# Altium schematic sheet XMOS_MAX3420E.SchDoc: MAXIM MAX3420E USB Device Module
size A4
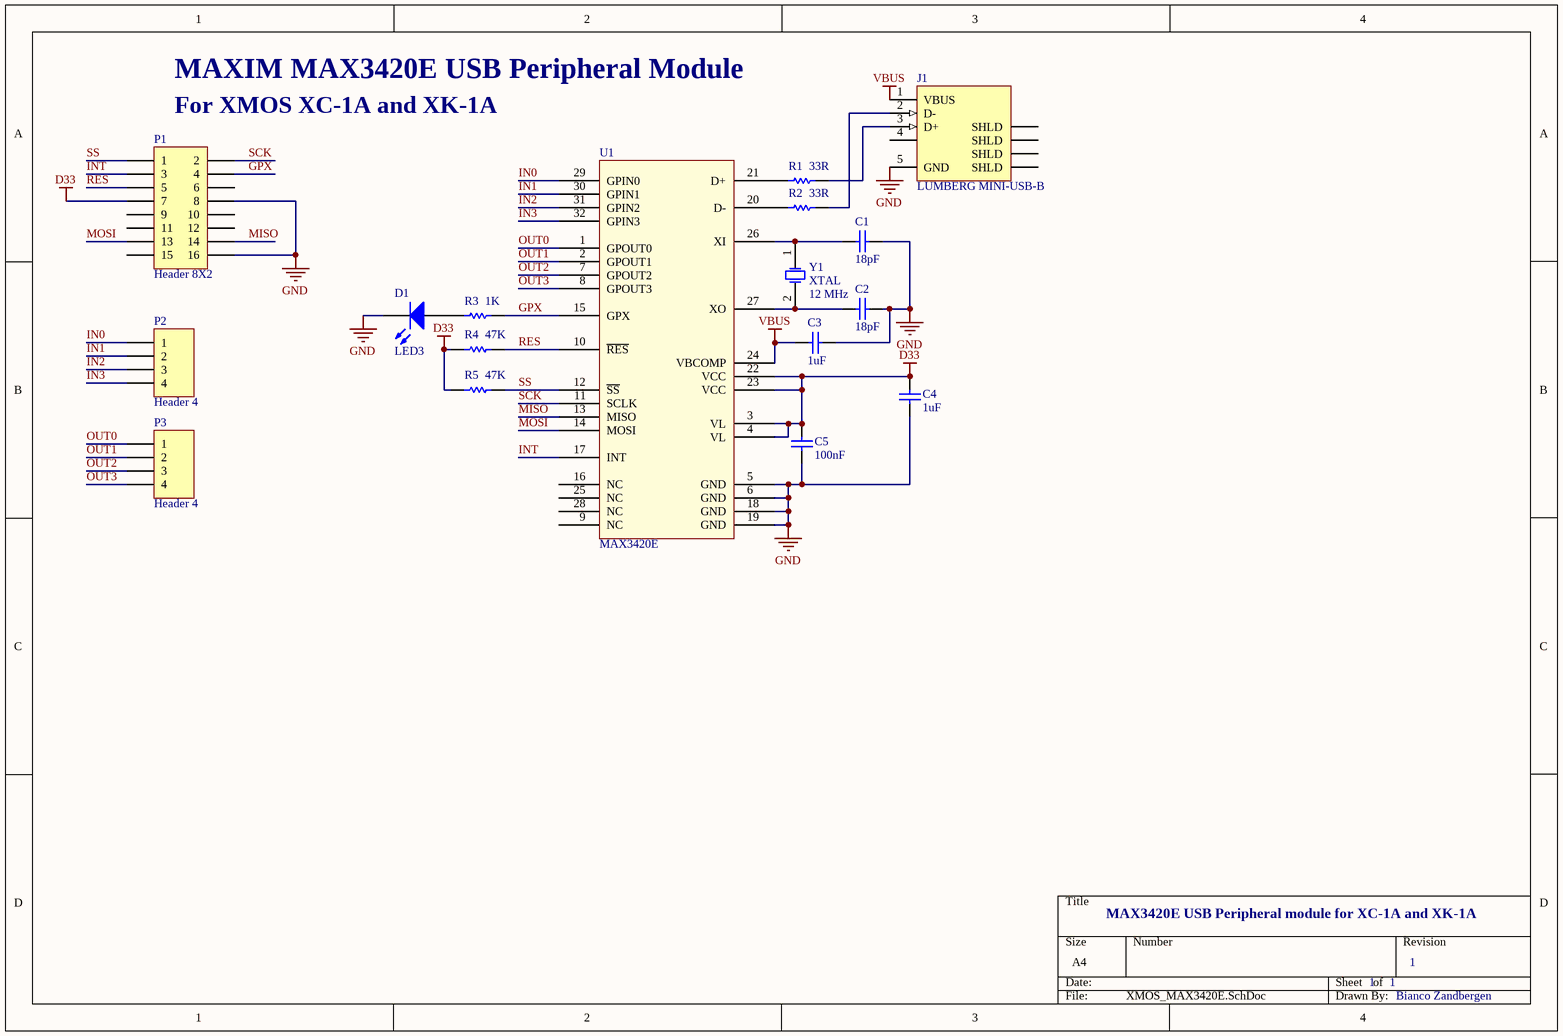
[diagram p0: XMOS_MAX3420E.SchDoc]

## Parts
C1  value 18pF  [1608[0603]_CAP]  (hidden comment: Cap)
C2  value 18pF  [1608[0603]_CAP]  (hidden comment: Cap)
C3  value 1uF  [1608[0603]_CAP]  (hidden comment: Cap)
C4  value 1uF  [1608[0603]_CAP]  (hidden comment: Cap)
C5  value 100nF  [1608[0603]_CAP]  (hidden comment: Cap)
D1  LED3  [2012[0805]_LED]
J1  LUMBERG MINI-USB-B  [LUMBERG mini USB-B]
P1  Header 8X2  [HDR2X8]
P2  Header 4  [HDR1X4]
P3  Header 4  [HDR1X4]
R1  value 33R  [1608[0603]_RES]  (hidden comment: Res)
R2  value 33R  [1608[0603]_RES]  (hidden comment: Res)
R3  value 1K  [1608[0603]_RES]  (hidden comment: Res)
R4  value 47K  [1608[0603]_RES]  (hidden comment: Res)
R5  value 47K  [1608[0603]_RES]  (hidden comment: Res)
U1  MAX3420E  [TQFP80P900X900-32N]
Y1  XTAL  value 12 MHz  [HC49/4H_SMX]

## Nets
D33: C4.2 C5.2 P1.7 R4.1 R5.1 U1.3(VL) U1.4(VL) U1.22(VCC) U1.23(VCC)
GND: C1.2 C2.2 C3.1 C4.1 C5.1 D1.2(K) J1.5(GND) P1.8 P1.16 U1.5(GND) U1.6(GND) U1.18(GND) U1.19(GND)
VBUS: C3.2 J1.1(VBUS) U1.24(VBCOMP)
GPX: P1.4 R3.2 U1.15(GPX)
IN0: P2.1 U1.29(GPIN0)
IN1: P2.2 U1.30(GPIN1)
IN2: P2.3 U1.31(GPIN2)
IN3: P2.4 U1.32(GPIN3)
INT: P1.3 U1.17(INT)
MISO: P1.14 U1.13(MISO)
MOSI: P1.13 U1.14(MOSI)
OUT0: P3.1 U1.1(GPOUT0)
OUT1: P3.2 U1.2(GPOUT1)
OUT2: P3.3 U1.7(GPOUT2)
OUT3: P3.4 U1.8(GPOUT3)
RES: P1.5 R4.2 U1.10(~{RES})
SCK: P1.2 U1.11(SCLK)
SS: P1.1 R5.2 U1.12(~{SS})
NetC1_1: C1.1 U1.26(XI) Y1.1(OSC1)
NetC2_1: C2.1 U1.27(XO) Y1.2(OSC2)
NetD1_1: D1.1(A) R3.1
NetJ1_2: J1.2(D-) R2.2
NetJ1_3: J1.3(D+) R1.2
NetR1_1: R1.1 U1.21(D+)
NetR2_1: R2.1 U1.20(D-)

Not connected (* = marked no-connect by the designer): J1 4 6(SHLD) 7(SHLD) 8(SHLD) 9(SHLD); P1 6 9 10 11 12 15; U1 9(NC) 16(NC) 25(NC) 28(NC)

## Notes on the sheet
- MAXIM MAX3420E USB Peripheral Module
- (near P1) For XMOS XC-1A and XK-1A
- MAX3420E USB Peripheral module for XC-1A and XK-1A
- 1
- Bianco Zandbergen

## Library data of the parts
C1 = Cap: Capacitor; Manufacturer: MURATA; ProductCode: GRM1885C1H180JA01D; Published: 8-Jun-2000; LatestRevisionDate: 17-Jul-2002; LatestRevisionNote: Re-released for DXP Platform.; PackageReference: RAD-0.3; Publisher: Altium Limited; Supplier: Farnell; SupplierSKU: 1828908; Price: 0,03
C2 C4 = Cap: Capacitor; Published: 8-Jun-2000; LatestRevisionDate: 17-Jul-2002; LatestRevisionNote: Re-released for DXP Platform.; PackageReference: RAD-0.3; Publisher: Altium Limited
C3 = Cap: Capacitor; Manufacturer: KEMET; ProductCode: C0603C105K4RACTU; Published: 8-Jun-2000; LatestRevisionDate: 17-Jul-2002; LatestRevisionNote: Re-released for DXP Platform.; PackageReference: RAD-0.3; Publisher: Altium Limited; Supplier: Farnell; SupplierSKU: 1650837; Price: 0,16
C5 = Cap: Capacitor; Manufacturer: MURATA; ProductCode: GRM188R71H104KA93D; Published: 8-Jun-2000; LatestRevisionDate: 17-Jul-2002; LatestRevisionNote: Re-released for DXP Platform.; PackageReference: RAD-0.3; Publisher: Altium Limited; Supplier: Farnell; SupplierSKU: 8820023; Price: 0,05
D1 = LED3: SMD LED 0805; Manufacturer: KINGBRIGHT; Value: Orange; ProductCode: KPHCM-2012SECK; Published: 8-Jun-2000; LatestRevisionDate: 17-Dec-2003; LatestRevisionNote: PCB Footprint replaced.; DatasheetVersion: 16-Apr-2002; PackageVersion: 16-Apr-2002; PackageReference: 3.5X2.8X1.9; Publisher: Altium Limited; Supplier: Farnell; SupplierSKU: 1686068; Price: 0,16
J1 = LUMBERG MINI-USB-B: MINI USB TYPE B, RECEPTACLE, SMT; ContactMaterial: Phosphor Bronze; ContactPlating: Gold (30) over Nickel; PCB_Layout: Complies with manufacturer's recommendation.; DrillSize: Corresponds to nominal value.; PanelGround: Without; ProductCode: 2486 01; Published: 15-Jul-2004; DatasheetDocument: 15-Nov-2002; PackageDocument: 15-Nov-2002; PackageReference: 440478; Publisher: Altium Limited; HousingMaterial: Thermoplastic; ComponentLink1Description: Manufacturer Link; ComponentLink1URL: http://www.tycoelectronics.com/; ComponentLink2Description: Packaging Specification; ComponentLink2URL: http://ecommas.tycoelectronics.com/commerce/DocumentDelivery/DDEController?Action=showdoc&DocId=Customer+Drawing%7F440478%7FB%7Fpdf%7FEnglish%7FC_440478_B.pdf; Manufacturer: LUMBERG; Supplier: Farnell; SupplierSKU: 1243250; Price: 2,14
P1 = Header 8X2: Header, 8-Pin, Dual row; Manufacturer: FISCHER ELEKTRONIK; ProductCode: BL4.72Z; LatestRevisionDate: 17-Jul-2002; LatestRevisionNote: Re-released for DXP Platform.; Publisher: Altium Limited; Supplier: Farnell; SupplierSKU: 9728902; Price: 6,60
P2 P3 = Header 4: Header, 4-Pin; LatestRevisionDate: 17-Jul-2002; LatestRevisionNote: Re-released for DXP Platform.; Publisher: Altium Limited
  P3: Price: 0,00
R1 = Res: Resistor; Manufacturer: PANASONIC; ProductCode: ERJ3GEYJ330V; Published: 8-Jun-2000; LatestRevisionDate: 17-Jul-2002; LatestRevisionNote: Re-released for DXP Platform.; PackageReference: AXIAL-0.3; Publisher: Altium Limited; Supplier: Farnell; SupplierSKU: 2059561; Price: 0,01
R2 R4 = Res: Resistor; Published: 8-Jun-2000; LatestRevisionDate: 17-Jul-2002; LatestRevisionNote: Re-released for DXP Platform.; PackageReference: AXIAL-0.3; Publisher: Altium Limited
R3 = Res: Resistor; Manufacturer: PANASONIC; ProductCode: ERJ3GEYJ102V; Published: 8-Jun-2000; LatestRevisionDate: 17-Jul-2002; LatestRevisionNote: Re-released for DXP Platform.; PackageReference: AXIAL-0.3; Publisher: Altium Limited; Supplier: Farnell; SupplierSKU: 2059601; Price: 0,01
R5 = Res: Resistor; Manufacturer: PANASONIC; ProductCode: ERJ3GEYJ473V; Published: 8-Jun-2000; LatestRevisionDate: 17-Jul-2002; LatestRevisionNote: Re-released for DXP Platform.; PackageReference: AXIAL-0.3; Publisher: Altium Limited; Supplier: Farnell; SupplierSKU: 2059646; Price: 0,01
U1 = MAX3420E: USB Controller SPI Interface; Manufacturer: MAXIM IC; ProductCode: MAX3420EECJ+; Supplier: Farnell; SupplierSKU: 1593354; Price: 11,20
Y1 = XTAL: Crystal Oscillator; Manufacturer: ABRACON; ProductCode: ABLS2-12.000MHZ-D4Y-T; Published: 8-Jun-2000; LatestRevisionDate: 17-Jul-2002; LatestRevisionNote: Re-released for DXP Platform.; PackageReference: R38; Publisher: Altium Limited; Supplier: Farnell; SupplierSKU: 2101325; Price: 0,56